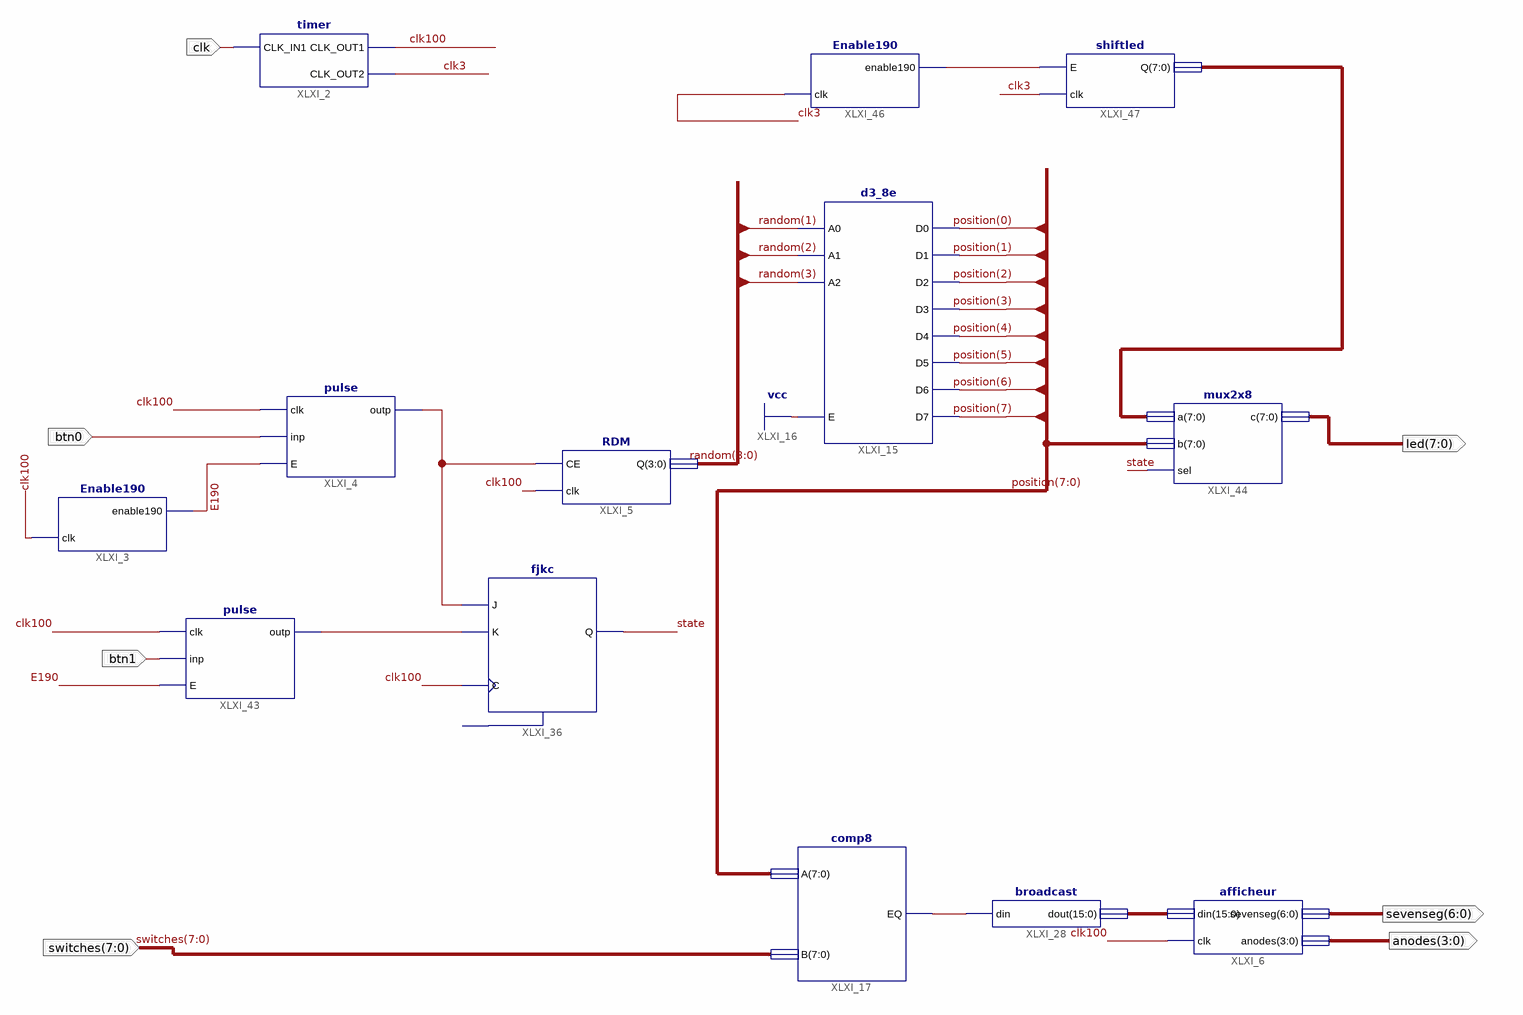
[diagram p0: schematic sheet 1]
// Xilinx ISE schematic toplevel.sch (spartan6) as structural Verilog: 13 symbols, 7 ports
module toplevel (
  input  clk,
  input  btn0,
  input  [7:0] switches,
  input  btn1,
  output [7:0] led,
  output [6:0] sevenseg,
  output [3:0] anodes
);

  wire clk3, clk100, E190, state, XLXN_82, XLXN_113, XLXN_114, XLXN_121;
  wire [3:0] random;
  wire [7:0] position, XLXN_119;
  wire [15:0] XLXN_83;

  timer XLXI_2 (.CLK_IN1(clk), .CLK_OUT1(clk100), .CLK_OUT2(clk3));
  Enable190 XLXI_3 (.enable190(E190), .clk(clk100));
  pulse XLXI_4 (.clk(clk100), .inp(btn0), .E(E190), .outp(XLXN_113));
  d3_8e XLXI_15 (
    .A0(random[1]), .A1(random[2]), .A2(random[3]), .E(1'b1), .D0(position[0]), .D1(position[1]),
    .D2(position[2]), .D3(position[3]), .D4(position[4]), .D5(position[5]), .D6(position[6]), .D7(position[7]));
  RDM XLXI_5 (.CE(XLXN_113), .clk(clk100), .Q(random));
  fjkc XLXI_36 (.C(clk100), .J(XLXN_113), .K(XLXN_114), .Q(state));  // open: CLR
  broadcast XLXI_28 (.din(XLXN_82), .dout(XLXN_83));
  comp8 XLXI_17 (.A(position), .B(switches), .EQ(XLXN_82));
  afficheur XLXI_6 (.din(XLXN_83), .clk(clk100), .sevenseg(sevenseg), .anodes(anodes));
  pulse XLXI_43 (.clk(clk100), .inp(btn1), .E(E190), .outp(XLXN_114));
  mux2x8 XLXI_44 (.a(XLXN_119), .b(position), .sel(state), .c(led));
  Enable190 XLXI_46 (.enable190(XLXN_121), .clk(clk3));
  shiftled XLXI_47 (.E(XLXN_121), .clk(clk3), .Q(XLXN_119));
endmodule
